# Altium schematic sheet moto.SchDoc
size A4
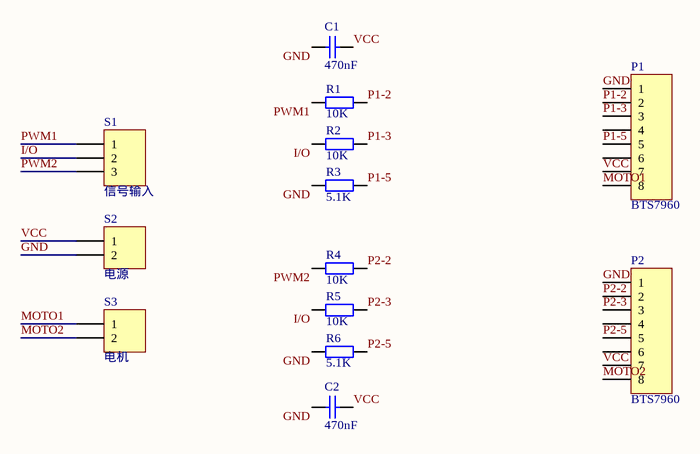
[diagram p0: moto.SchDoc]

## Parts
C1  470nF  [0805]
C2  470nF  [0805]
P1  BTS7960  [BTS7970B]
P2  BTS7960  [BTS7970B]
R1  10K  [0805]
R2  10K  [0805]
R3  5.1K  [0805]
R4  10K  [0805]
R5  10K  [0805]
R6  5.1K  [0805]
S1  信号输入  [HDR1X3]
S2  电源  [tongzhu]
S3  电机  [tongzhu]

## Nets
GND: C1.1 C2.1 P1.1 P2.1 R3.2 R6.2 S2.2
I/O: R2.2 R5.2 S1.2
MOTO1: P1.8 S3.1
MOTO2: P2.8 S3.2
P1-2: P1.2 R1.2
P1-3: P1.3 R2.1
P1-5: P1.5 R3.1
P2-2: P2.2 R4.2
P2-3: P2.3 R5.1
P2-5: P2.5 R6.1
PWM1: R1.1 S1.1
PWM2: R4.1 S1.3
VCC: C1.2 C2.2 P1.7 P2.7 S2.1

Not connected (* = marked no-connect by the designer): P1 4 6; P2 4 6

## Library data of the parts
C1 C2 = Cap: Capacitor; Published: 8-Jun-2000; LatestRevisionDate: 17-Jul-2002; LatestRevisionNote: Re-released for DXP Platform.; Publisher: Altium Limited
P1 P2 = Header 8: Header, 8-Pin; LatestRevisionDate: 17-Jul-2002; LatestRevisionNote: Re-released for DXP Platform.; Publisher: Altium Limited
R1-R6 = Res2: Resistor; Published: 8-Jun-2000; LatestRevisionDate: 17-Jul-2002; LatestRevisionNote: Re-released for DXP Platform.; Publisher: Altium Limited
S1 = Header 3: Header, 3-Pin; LatestRevisionDate: 17-Jul-2002; LatestRevisionNote: Re-released for DXP Platform.; Publisher: Altium Limited
S2 S3 = Header 2: Header, 2-Pin; pin to pad: 1>2 2>1; LatestRevisionDate: 17-Jul-2002; LatestRevisionNote: Re-released for DXP Platform.; Publisher: Altium Limited